# EasyEDA Pro project stm32f407vet6.eprj

# Schematic STM32F407VET6V1

## Sheets
1 P1: Create Date: 2024-05-11; Page Name: P1; Project Name: stm32f407vet6; Schematic Name: STM32F407VET6V1; Update Date: 2024-06-07; Company: 嘉立创EDA; Page Size: A4; Version: V1.0
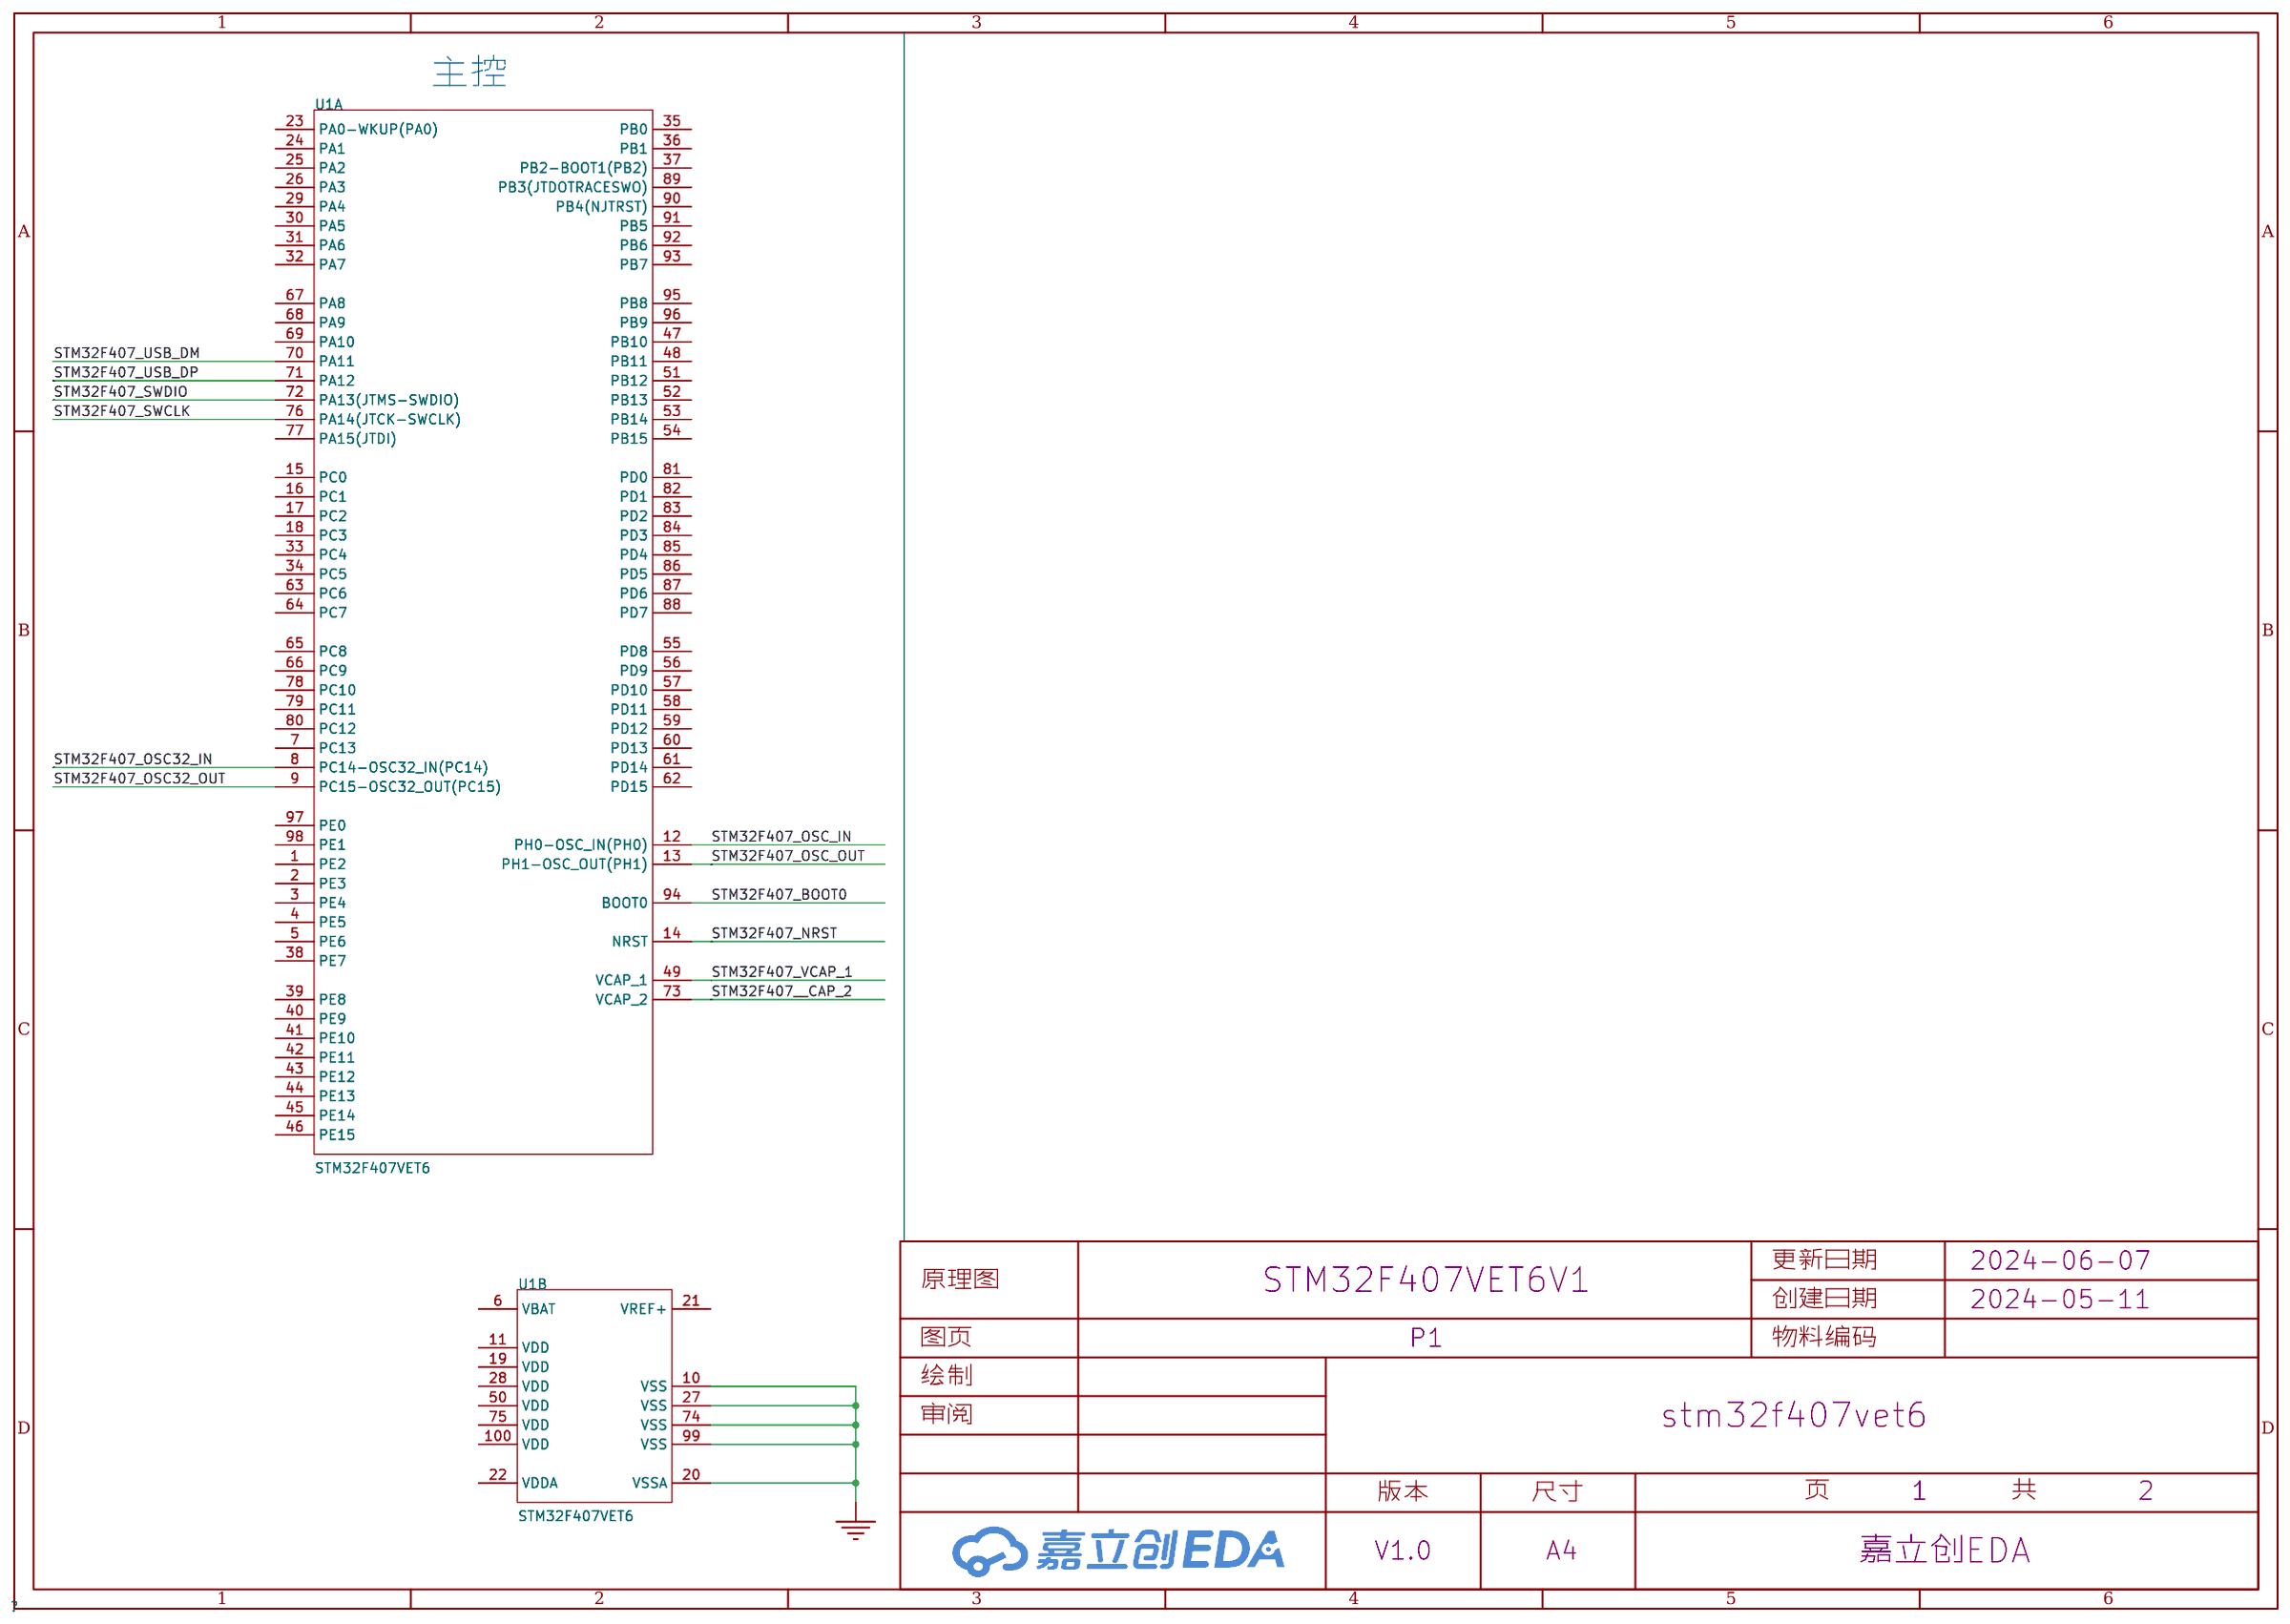
[diagram p0: P1]
2 P2: Page Name: P2; Update Date: 2024-06-04
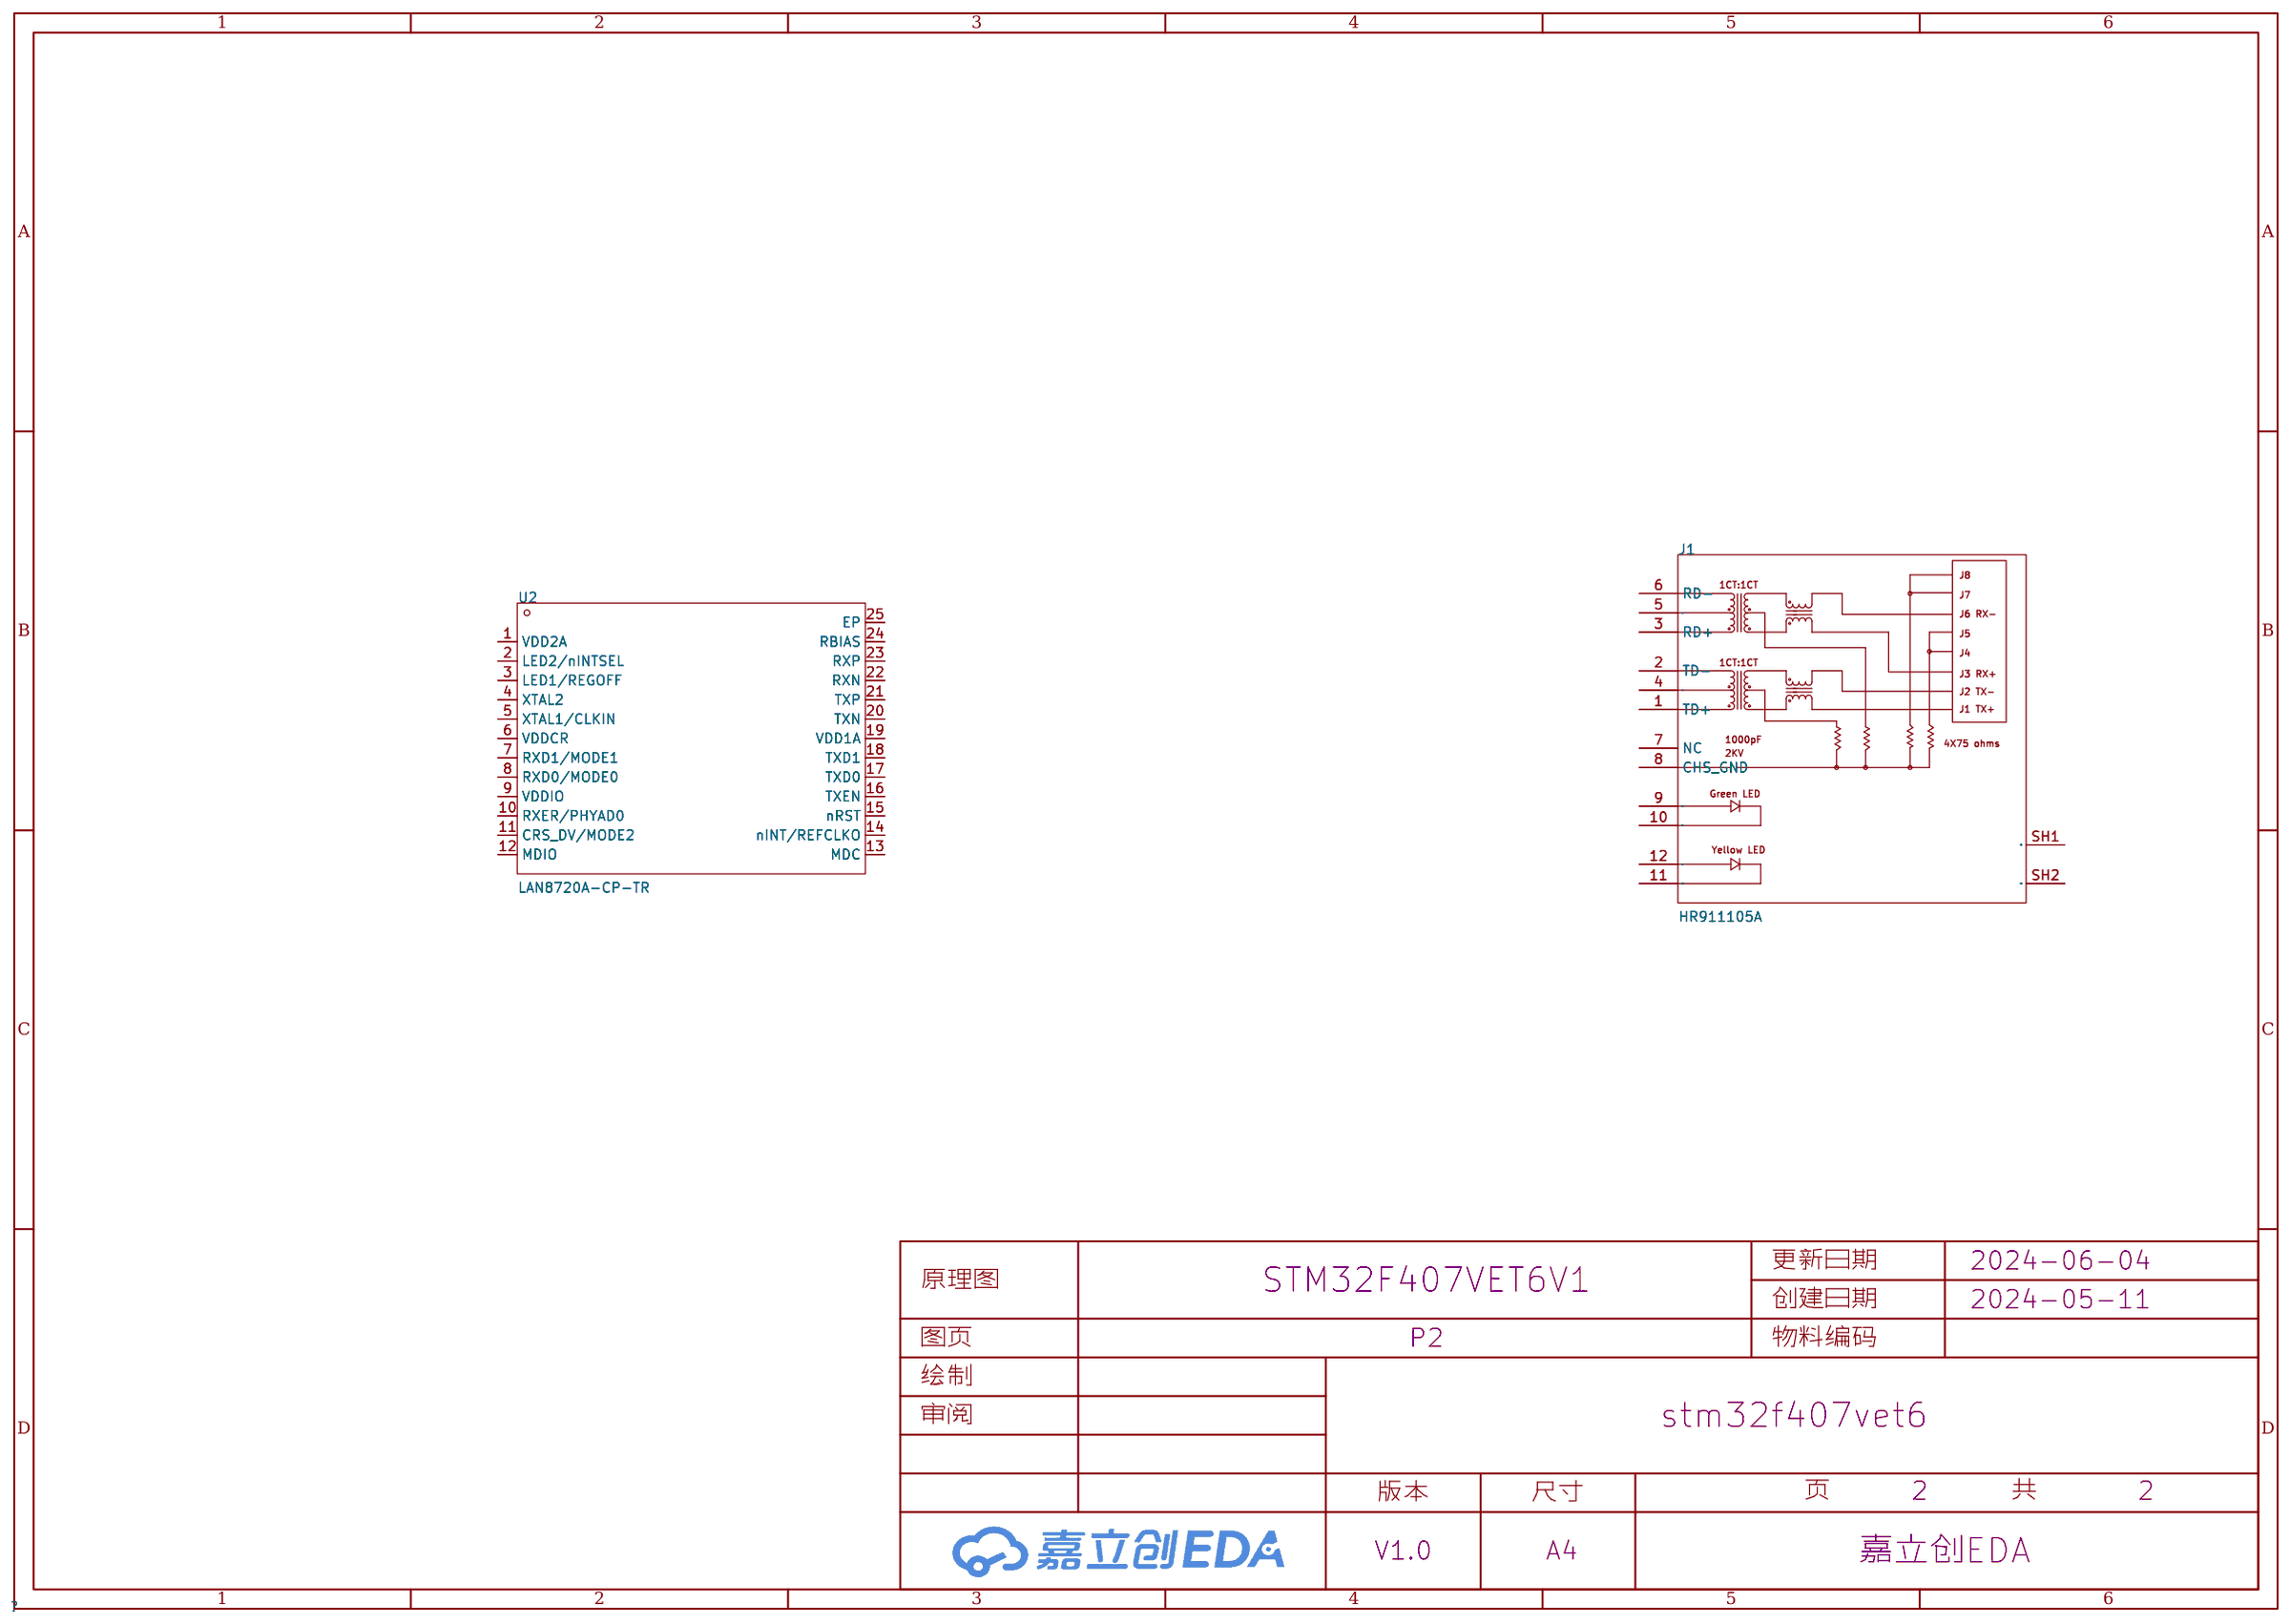
[diagram p1: P2]

## Parts
sheet P1
U1  STM32F407VET6  [LQFP-100_L14.0-W14.0-P0.50-LS16.0-BL]  (sections 1,2)
sheet P2
J1  HR911105A  [RJ45-TH_HR911105A]
U2  LAN8720A-CP-TR  [QFN-24_L4.0-W4.0-P0.50-BL-EP2.6]

## Library data of the parts
U1 = STM32F407VET6: CPU内核:CM4;程序存储容量:512KB;RAM总容量:192KB;GPIO端口数量:82;工作电压范围:1.8V~3.6V;CPU最大主频:168MHz;程序存储器类型:FLASH;; Supplier Part: C28730; Manufacturer: ST(意法半导体); Supplier Footprint: LQFP-100(14x14); JLCPCB Part Class: 扩展库; Datasheet: https://atta.szlcsc.com/upload/public/pdf/source/20140801/1457707197138.pdf; Supplier: LCSC; CPU Core: CM4; Program Storage Size: 512KB; RAM Size: 192KB; GPIO Ports Number: 82; Operating Voltage Range: 1.8V~3.6V; CPU Maximum Speed: 168MHz; Program Memory Type: FLASH; Operating Temperature Range: -40℃~+85℃; ADC (Bit): 12bit; DAC (Bit): 12bit; Universal Serial Bus: 有; Peripheral/Function: DMA；LCD/LED驱动；PWM; Watchdog: 有; Infrared Data Association: 有; Low-Voltage Detect: 有; LCD Module: 有; Direct Memory Access: 有; Internal Oscillator: 有
J1 = HR911105A_C12074: 连接器类型:RJ45插座;端口数量:1;安装方式:-;屏蔽:-;LED:带LED;等级:-;触头材质:-;触头镀层:-;工作温度范围:-;焊接温度(最大值):-;; LCSC Part Name: 带LED; Supplier Part: C12074; Manufacturer: HANRUN(汉仁); Supplier Footprint: 插件; JLCPCB Part Class: 扩展库; Datasheet: https://atta.szlcsc.com/upload/public/pdf/source/20170918/C12074_1505726819496976146.pdf; Supplier: LCSC; Connector Type: RJ45插座; Number of Ports: 1; LED: 带LED; PoE: 不带PoE; Supplementary Features: 带滤波
U2 = LAN8720A-CP-TR: 应用功能:收发器;通道数:1;接口类型:RMII;; Supplier Part: C45223; Manufacturer: MICROCHIP(美国微芯); Supplier Footprint: QFN-24-EP(4x4); JLCPCB Part Class: 扩展库; Datasheet: https://atta.szlcsc.com/upload/public/pdf/source/20151012/1457707444106.pdf; Supplier: LCSC; Application Function: 收发器; Number of Channels: 1; Interface: RMII; Supply Voltage: 1.6V~3.6V; Operating Temperature: 0℃~+85℃

## Nets
GND: U1.10(VSS) U1.20(VSSA) U1.27(VSS) U1.74(VSS) U1.99(VSS)
STM32F407__CAP_2: U1.73(VCAP_2)
STM32F407_BOOT0: U1.94(BOOT0)
STM32F407_NRST: U1.14(NRST)
STM32F407_OSC32_IN: U1.8(PC14-OSC32_IN(PC14))
STM32F407_OSC32_OUT: U1.9(PC15-OSC32_OUT(PC15))
STM32F407_OSC_IN: U1.12(PH0-OSC_IN(PH0))
STM32F407_OSC_OUT: U1.13(PH1-OSC_OUT(PH1))
STM32F407_SWCLK: U1.76(PA14(JTCK-SWCLK))
STM32F407_SWDIO: U1.72(PA13(JTMS-SWDIO))
STM32F407_USB_DM: U1.70(PA11)
STM32F407_USB_DP: U1.71(PA12)
STM32F407_VCAP_1: U1.49(VCAP_1)

Not connected (* = marked no-connect by the designer): J1 1(TD+) 2(TD-) 3(RD+) 4 5 6(RD-) 7(NC) 8(CHS GND) 9 10 11 12 SH1 SH2; U1 1(PE2) 2(PE3) 3(PE4) 4(PE5) 5(PE6) 6(VBAT) 7(PC13) 11(VDD) 15(PC0) 16(PC1) 17(PC2) 18(PC3) 19(VDD) 21(VREF+) 22(VDDA) 23(PA0-WKUP(PA0)) 24(PA1) 25(PA2) 26(PA3) 28(VDD) 29(PA4) 30(PA5) 31(PA6) 32(PA7) 33(PC4) 34(PC5) 35(PB0) 36(PB1) 37(PB2-BOOT1(PB2)) 38(PE7) 39(PE8) 40(PE9) 41(PE10) 42(PE11) 43(PE12) 44(PE13) 45(PE14) 46(PE15) 47(PB10) 48(PB11) 50(VDD) 51(PB12) 52(PB13) 53(PB14) 54(PB15) 55(PD8) 56(PD9) 57(PD10) 58(PD11) 59(PD12) 60(PD13) 61(PD14) 62(PD15) 63(PC6) 64(PC7) 65(PC8) 66(PC9) 67(PA8) 68(PA9) 69(PA10) 75(VDD) 77(PA15(JTDI)) 78(PC10) 79(PC11) 80(PC12) 81(PD0) 82(PD1) 83(PD2) 84(PD3) 85(PD4) 86(PD5) 87(PD6) 88(PD7) 89(PB3(JTDOTRACESWO)) 90(PB4(NJTRST)) 91(PB5) 92(PB6) 93(PB7) 95(PB8) 96(PB9) 97(PE0) 98(PE1) 100(VDD); U2 1(VDD2A) 2(LED2/nINTSEL) 3(LED1/REGOFF) 4(XTAL2) 5(XTAL1/CLKIN) 6(VDDCR) 7(RXD1/MODE1) 8(RXD0/MODE0) 9(VDDIO) 10(RXER/PHYAD0) 11(CRS_DV/MODE2) 12(MDIO) 13(MDC) 14(nINT/REFCLKO) 15(nRST) 16(TXEN) 17(TXD0) 18(TXD1) 19(VDD1A) 20(TXN) 21(TXP) 22(RXN) 23(RXP) 24(RBIAS) 25(EP)

## Notes on the sheets
sheet 1
- 主控

# Schematic STM32F407VET6V2
Create Date: 2024-06-05; Page Name: P1; Project Name: stm32f407vet6; Schematic Name: STM32F407VET6V2; Update Date: 2024-06-07; Company: 嘉立创EDA; Page Size: A4; Version: V1.0
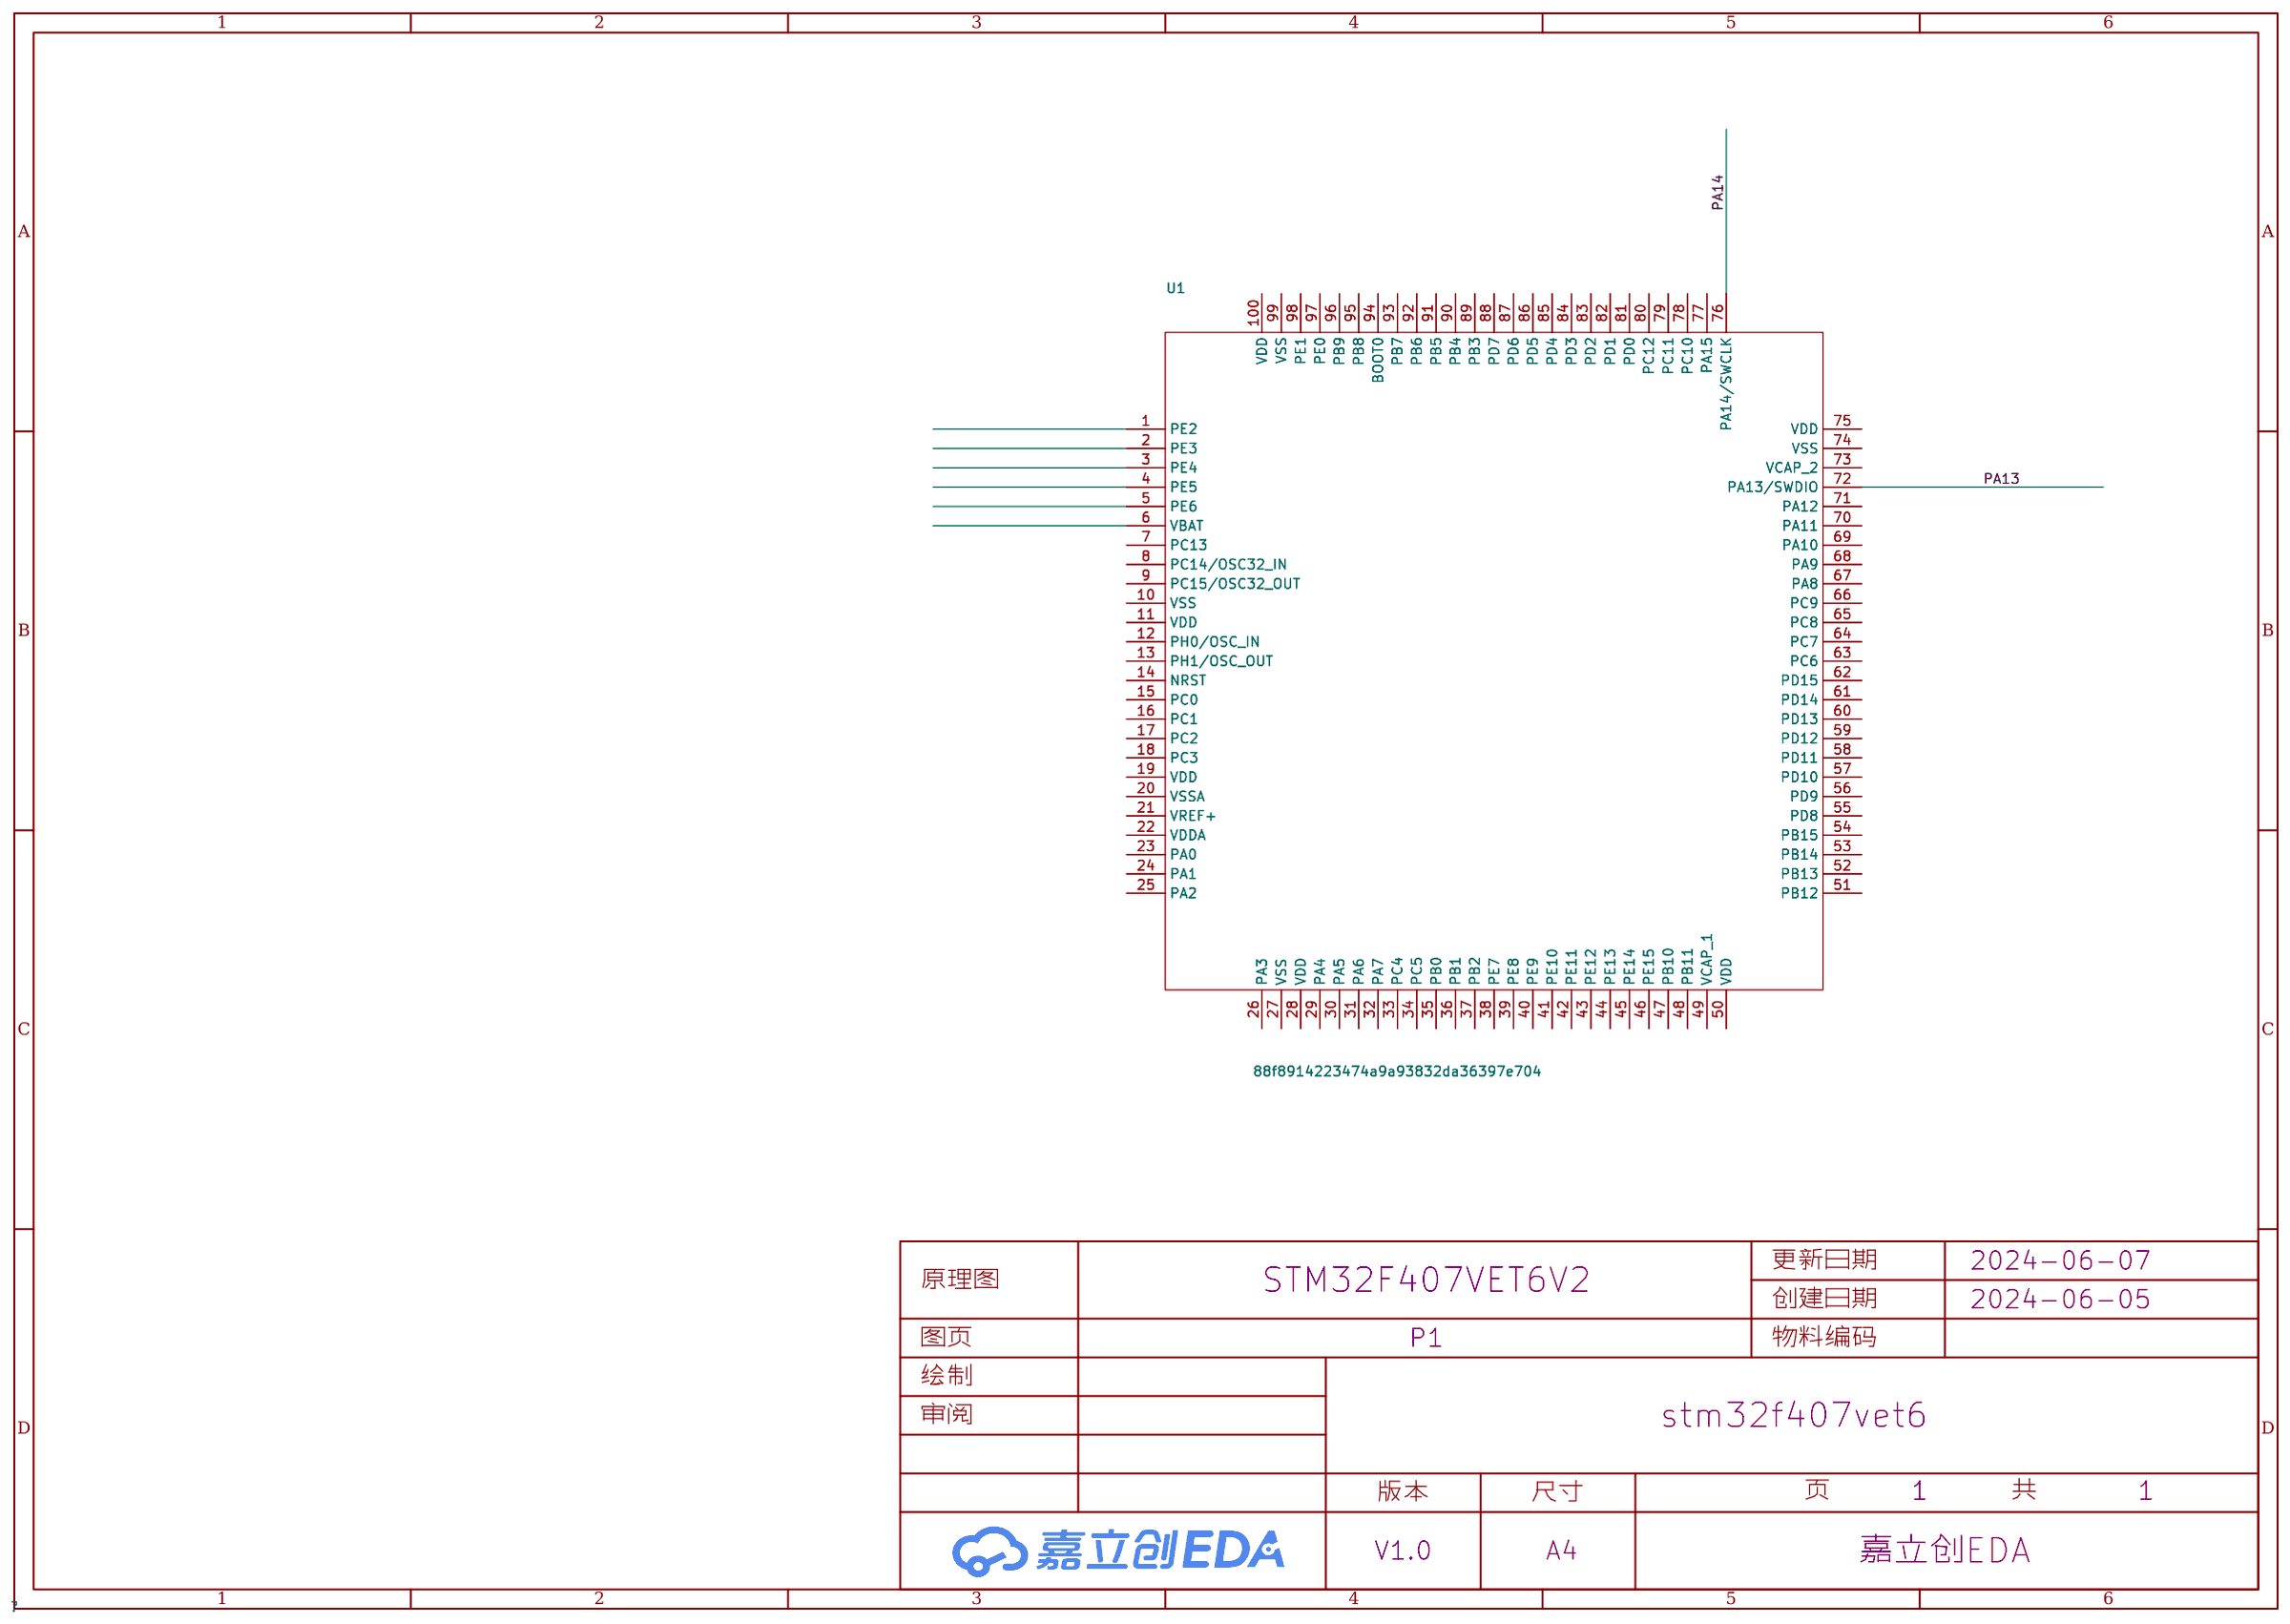
[diagram p2: schematic sheet]

## Parts
U1  88f8914223474a9a93832da36397e704  [LQFP-100_L14.0-W14.0-P0.50-LS16.0-TL_1]

## Library data of the parts
U1 = STM32F407VET6

## Nets
PA13: U1.72(PA13/SWDIO)
PA14: U1.76(PA14/SWCLK)

Not connected (* = marked no-connect by the designer): U1 1(PE2) 2(PE3) 3(PE4) 4(PE5) 5(PE6) 6(VBAT) 7(PC13) 8(PC14/OSC32_IN) 9(PC15/OSC32_OUT) 10(VSS) 11(VDD) 12(PH0/OSC_IN) 13(PH1/OSC_OUT) 14(NRST) 15(PC0) 16(PC1) 17(PC2) 18(PC3) 19(VDD) 20(VSSA) 21(VREF+) 22(VDDA) 23(PA0) 24(PA1) 25(PA2) 26(PA3) 27(VSS) 28(VDD) 29(PA4) 30(PA5) 31(PA6) 32(PA7) 33(PC4) 34(PC5) 35(PB0) 36(PB1) 37(PB2) 38(PE7) 39(PE8) 40(PE9) 41(PE10) 42(PE11) 43(PE12) 44(PE13) 45(PE14) 46(PE15) 47(PB10) 48(PB11) 49(VCAP_1) 50(VDD) 51(PB12) 52(PB13) 53(PB14) 54(PB15) 55(PD8) 56(PD9) 57(PD10) 58(PD11) 59(PD12) 60(PD13) 61(PD14) 62(PD15) 63(PC6) 64(PC7) 65(PC8) 66(PC9) 67(PA8) 68(PA9) 69(PA10) 70(PA11) 71(PA12) 73(VCAP_2) 74(VSS) 75(VDD) 77(PA15) 78(PC10) 79(PC11) 80(PC12) 81(PD0) 82(PD1) 83(PD2) 84(PD3) 85(PD4) 86(PD5) 87(PD6) 88(PD7) 89(PB3) 90(PB4) 91(PB5) 92(PB6) 93(PB7) 94(BOOT0) 95(PB8) 96(PB9) 97(PE0) 98(PE1) 99(VSS) 100(VDD)

# Board STM32F407VET6V1
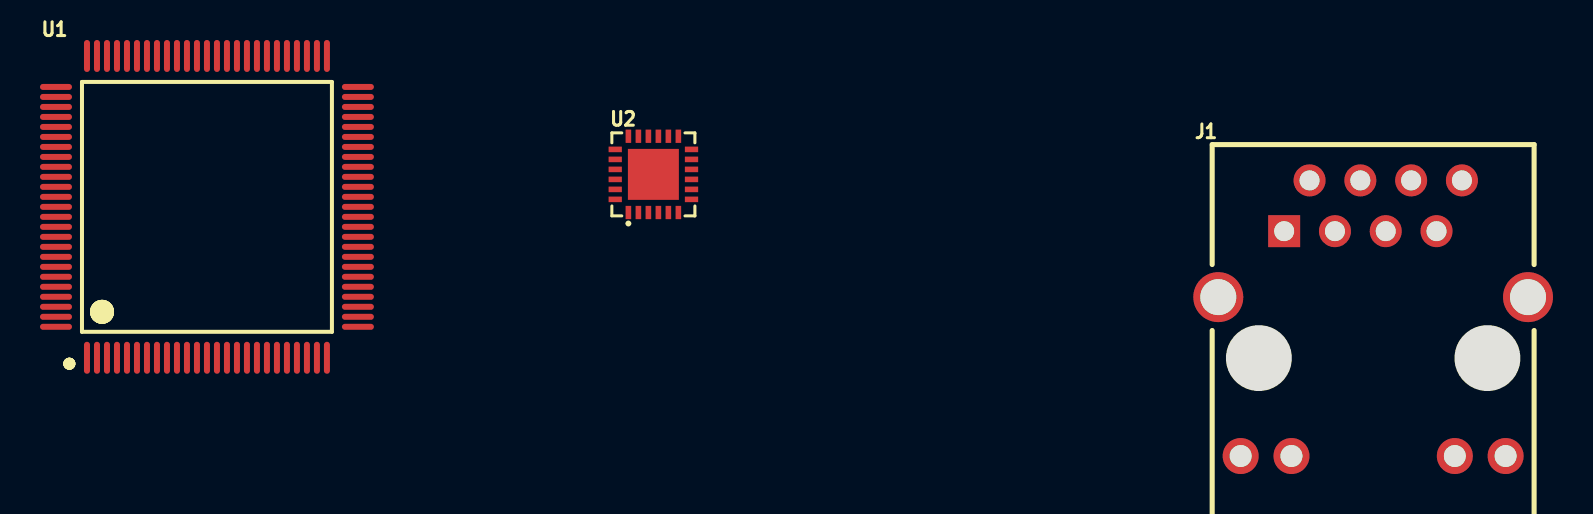
[diagram p3: board, top side]
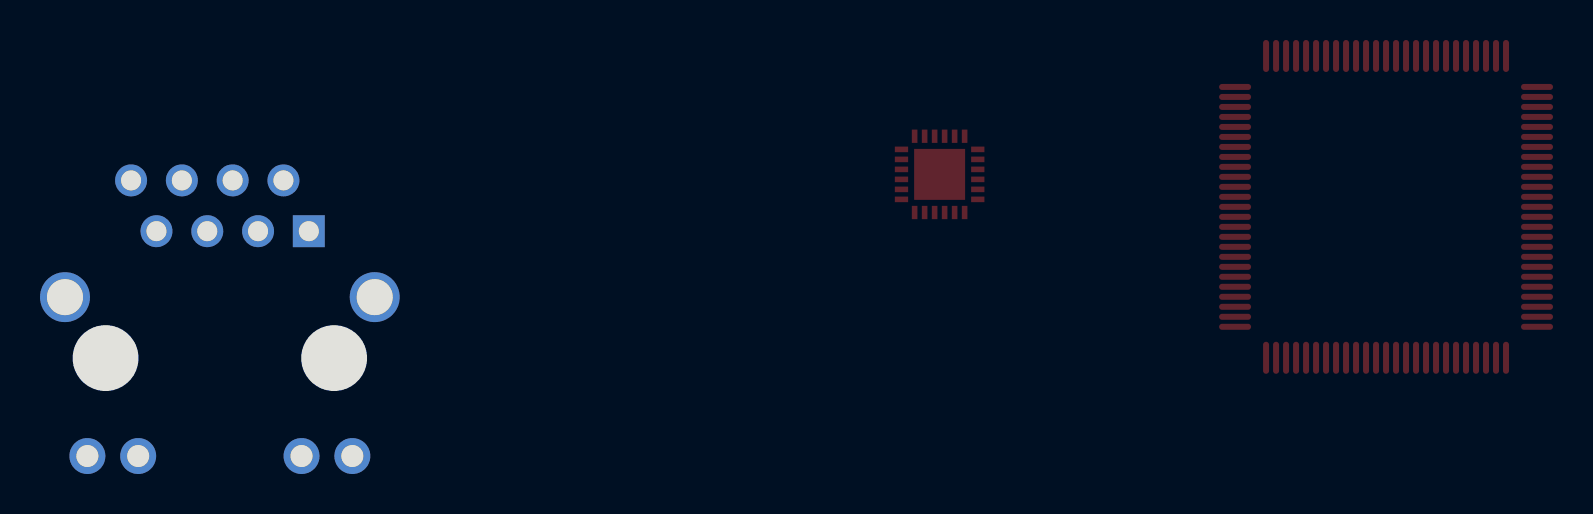
[diagram p4: board, bottom side, seen from below]

Outline 14.72 x 3.29 mm; copper layers: Top Layer, Bottom Layer. Coordinates in mm from the lower left corner of the outline.
Stack: Top Layer 0.035mm / Dielectric1 1.51mm FR4 er 4.5 / Bottom Layer 0.035mm

## Design rules (mm)
template: JLCPCB Capability(Two Layers Board)
spacing copperThickness1oz (default): track to track 0.102, other pairs 0.152 to 0.3
spacing copperThickness2oz: track to track 0.203, other pairs 0.152 to 0.3
track width copperThickness1oz (default): min 0.127, default 0.254, max 2.54
track width copperThickness2oz: min 0.203, default 0.254, max 2.54
differential pair differentialPair (default): width min 0.127, default 0.254, max 2.54; gap min 0.152, default 0.152
via viaSize (default): diameter min 0.5, default 0.61, max 10; hole min 0.3, default 0.305, max 6.3

## Placement (name value [footprint] x y rotation side)
J1  HR911105A  [RJ45-TH_HR911105A]  7.36 3.64 0 top
U1  STM32F407VET6  [LQFP-100_L14.0-W14.0-P0.50-LS16.0-BL]  -50.96 9.21 0 top
U2  LAN8720A-CP-TR  [QFN-24_L4.0-W4.0-P0.50-BL-EP2.6]  -28.64 10.84 0 top

## Footprints (pads in the part's own frame, mm; a bottom-side part is the same pattern mirrored in y, then rotated)
LQFP-100_L14.0-W14.0-P0.50-LS16.0-BL
  oval 0.3x1.6 smd: 1(-6,-7.55) 2(-5.5,-7.55) 3(-5,-7.55) 4(-4.5,-7.55) 5(-4,-7.55) 6(-3.5,-7.55) 7(-3,-7.55) 8(-2.5,-7.55) 9(-2,-7.55) 10(-1.5,-7.55) 11(-1,-7.55) 12(-0.5,-7.55) 13(0,-7.55) 14(0.5,-7.55) 15(1,-7.55) 16(1.5,-7.55) 17(2,-7.55) 18(2.5,-7.55) 19(3,-7.55) 20(3.5,-7.55) 21(4,-7.55) 22(4.5,-7.55) 23(5,-7.55) 24(5.5,-7.55) 25(6,-7.55) 51(6,7.55) 52(5.5,7.55) 53(5,7.55) 54(4.5,7.55) 55(4,7.55) 56(3.5,7.55) 57(3,7.55) 58(2.5,7.55) 59(2,7.55) 60(1.5,7.55) 61(1,7.55) 62(0.5,7.55) 63(0,7.55) 64(-0.5,7.55) 65(-1,7.55) 66(-1.5,7.55) 67(-2,7.55) 68(-2.5,7.55) 69(-3,7.55) 70(-3.5,7.55) 71(-4,7.55) 72(-4.5,7.55) 73(-5,7.55) 74(-5.5,7.55) 75(-6,7.55)
  oval 1.6x0.3 smd: 26(7.55,-6) 27(7.55,-5.5) 28(7.55,-5) 29(7.55,-4.5) 30(7.55,-4) 31(7.55,-3.5) 32(7.55,-3) 33(7.55,-2.5) 34(7.55,-2) 35(7.55,-1.5) 36(7.55,-1) 37(7.55,-0.5) 38(7.55,0) 39(7.55,0.5) 40(7.55,1) 41(7.55,1.5) 42(7.55,2) 43(7.55,2.5) 44(7.55,3) 45(7.55,3.5) 46(7.55,4) 47(7.55,4.5) 48(7.55,5) 49(7.55,5.5) 50(7.55,6) 76(-7.55,6) 77(-7.55,5.5) 78(-7.55,5) 79(-7.55,4.5) 80(-7.55,4) 81(-7.55,3.5) 82(-7.55,3) 83(-7.55,2.5) 84(-7.55,2) 85(-7.55,1.5) 86(-7.55,1) 87(-7.55,0.5) 88(-7.55,0) 89(-7.55,-0.5) 90(-7.55,-1) 91(-7.55,-1.5) 92(-7.55,-2) 93(-7.55,-2.5) 94(-7.55,-3) 95(-7.55,-3.5) 96(-7.55,-4) 97(-7.55,-4.5) 98(-7.55,-5) 99(-7.55,-5.5) 100(-7.55,-6)
QFN-24_L4.0-W4.0-P0.50-BL-EP2.6
  rect 0.28x0.665 smd: 1(-1.25,-1.907) 2(-0.75,-1.907) 3(-0.25,-1.907) 4(0.25,-1.907) 5(0.75,-1.907) 6(1.25,-1.907) 13(1.25,1.907) 14(0.75,1.907) 15(0.25,1.907) 16(-0.25,1.907) 17(-0.75,1.907) 18(-1.25,1.907)
  rect 0.665x0.28 smd: 7(1.907,-1.25) 8(1.907,-0.75) 9(1.907,-0.25) 10(1.907,0.25) 11(1.907,0.75) 12(1.907,1.25) 19(-1.907,1.25) 20(-1.907,0.75) 21(-1.907,0.25) 22(-1.907,-0.25) 23(-1.907,-0.75) 24(-1.907,-1.25)
  rect 2.55x2.55 smd: 25(0,0)
RJ45-TH_HR911105A
  rect 1.6x1.6 hole 1: 1(-4.45,4.355)
  round 1.6 hole 1: 2(-3.18,6.895) 3(-1.91,4.355) 4(-0.64,6.895) 5(0.63,4.355) 6(1.9,6.895) 7(3.17,4.355) 8(4.44,6.895)
  round 1.8 hole 1.1: 9(-6.625,-6.895) 10(-4.085,-6.895) 11(4.085,-6.895) 12(6.625,-6.895)
  round 2.5 hole 1.8: SH1(-7.745,1.055) SH2(7.745,1.055)

## Nets
As in the schematic.

Pads without a net: J1 1 2 3 4 5 6 7 8 9 10 11 12 SH1 SH2; U1 1 2 3 4 5 6 7 11 15 16 17 18 19 21 22 23 24 25 26 28 29 30 31 32 33 34 35 36 37 38 39 40 41 42 43 44 45 46 47 48 50 51 52 53 54 55 56 57 58 59 60 61 62 63 64 65 66 67 68 69 75 77 78 79 80 81 82 83 84 85 86 87 88 89 90 91 92 93 95 96 97 98 100; U2 1 2 3 4 5 6 7 8 9 10 11 12 13 14 15 16 17 18 19 20 21 22 23 24 25

# Board STM32F407VET6V2
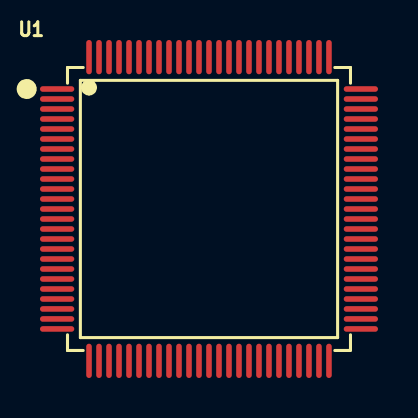
[diagram p5: board, top side]
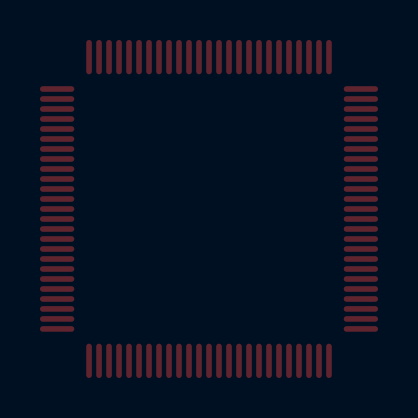
[diagram p6: board, bottom side, seen from below]

No outline. copper layers: Top Layer, Bottom Layer. Coordinates in mm from the lowest, leftmost part position.
Stack: Top Layer 0.035mm / Dielectric1 1.51mm FR4 er 4.5 / Bottom Layer 0.035mm

## Design rules (mm)
template: JLCPCB Capability(Two Layers Board)
spacing copperThickness1oz (default): track to track 0.102, other pairs 0.152 to 0.3
spacing copperThickness2oz: track to track 0.203, other pairs 0.152 to 0.3
track width copperThickness1oz (default): min 0.127, default 0.254, max 2.54
track width copperThickness2oz: min 0.203, default 0.254, max 2.54
differential pair differentialPair (default): width min 0.127, default 0.254, max 2.54; gap min 0.152, default 0.152
via viaSize (default): diameter min 0.5, default 0.61, max 10; hole min 0.3, default 0.305, max 6.3

## Placement (name value [footprint] x y rotation side)
U1  88f8914223474a9a93832da36397e704  [LQFP-100_L14.0-W14.0-P0.50-LS16.0-TL_1]  0 0 0 top

## Footprints (pads in the part's own frame, mm; a bottom-side part is the same pattern mirrored in y, then rotated)
LQFP-100_L14.0-W14.0-P0.50-LS16.0-TL_1
  oval 1.715x0.28 smd: 1(-7.595,6) 2(-7.595,5.5) 3(-7.595,5) 4(-7.595,4.5) 5(-7.595,4) 6(-7.595,3.5) 7(-7.595,3) 8(-7.595,2.5) 9(-7.595,2) 10(-7.595,1.5) 11(-7.595,1) 12(-7.595,0.5) 13(-7.595,0) 14(-7.595,-0.5) 15(-7.595,-1) 16(-7.595,-1.5) 17(-7.595,-2) 18(-7.595,-2.5) 19(-7.595,-3) 20(-7.595,-3.5) 21(-7.595,-4) 22(-7.595,-4.5) 23(-7.595,-5) 24(-7.595,-5.5) 25(-7.595,-6) 51(7.595,-6) 52(7.595,-5.5) 53(7.595,-5) 54(7.595,-4.5) 55(7.595,-4) 56(7.595,-3.5) 57(7.595,-3) 58(7.595,-2.5) 59(7.595,-2) 60(7.595,-1.5) 61(7.595,-1) 62(7.595,-0.5) 63(7.595,0) 64(7.595,0.5) 65(7.595,1) 66(7.595,1.5) 67(7.595,2) 68(7.595,2.5) 69(7.595,3) 70(7.595,3.5) 71(7.595,4) 72(7.595,4.5) 73(7.595,5) 74(7.595,5.5) 75(7.595,6)
  oval 0.28x1.715 smd: 26(-6,-7.595) 27(-5.5,-7.595) 28(-5,-7.595) 29(-4.5,-7.595) 30(-4,-7.595) 31(-3.5,-7.595) 32(-3,-7.595) 33(-2.5,-7.595) 34(-2,-7.595) 35(-1.5,-7.595) 36(-1,-7.595) 37(-0.5,-7.595) 38(0,-7.595) 39(0.5,-7.595) 40(1,-7.595) 41(1.5,-7.595) 42(2,-7.595) 43(2.5,-7.595) 44(3,-7.595) 45(3.5,-7.595) 46(4,-7.595) 47(4.5,-7.595) 48(5,-7.595) 49(5.5,-7.595) 50(6,-7.595) 76(6,7.595) 77(5.5,7.595) 78(5,7.595) 79(4.5,7.595) 80(4,7.595) 81(3.5,7.595) 82(3,7.595) 83(2.5,7.595) 84(2,7.595) 85(1.5,7.595) 86(1,7.595) 87(0.5,7.595) 88(0,7.595) 89(-0.5,7.595) 90(-1,7.595) 91(-1.5,7.595) 92(-2,7.595) 93(-2.5,7.595) 94(-3,7.595) 95(-3.5,7.595) 96(-4,7.595) 97(-4.5,7.595) 98(-5,7.595) 99(-5.5,7.595) 100(-6,7.595)

## Nets
As in the schematic.

Pads without a net: U1 7 8 9 10 11 12 13 14 15 16 17 18 19 20 21 22 23 24 25 26 27 28 29 30 31 32 33 34 35 36 37 38 39 40 41 42 43 44 45 46 47 48 49 50 51 52 53 54 55 56 57 58 59 60 61 62 63 64 65 66 67 68 69 70 71 73 74 75 77 78 79 80 81 82 83 84 85 86 87 88 89 90 91 92 93 94 95 96 97 98 99 100
